# Altium schematic sheet StrainGuageNode.SchDoc
size A4
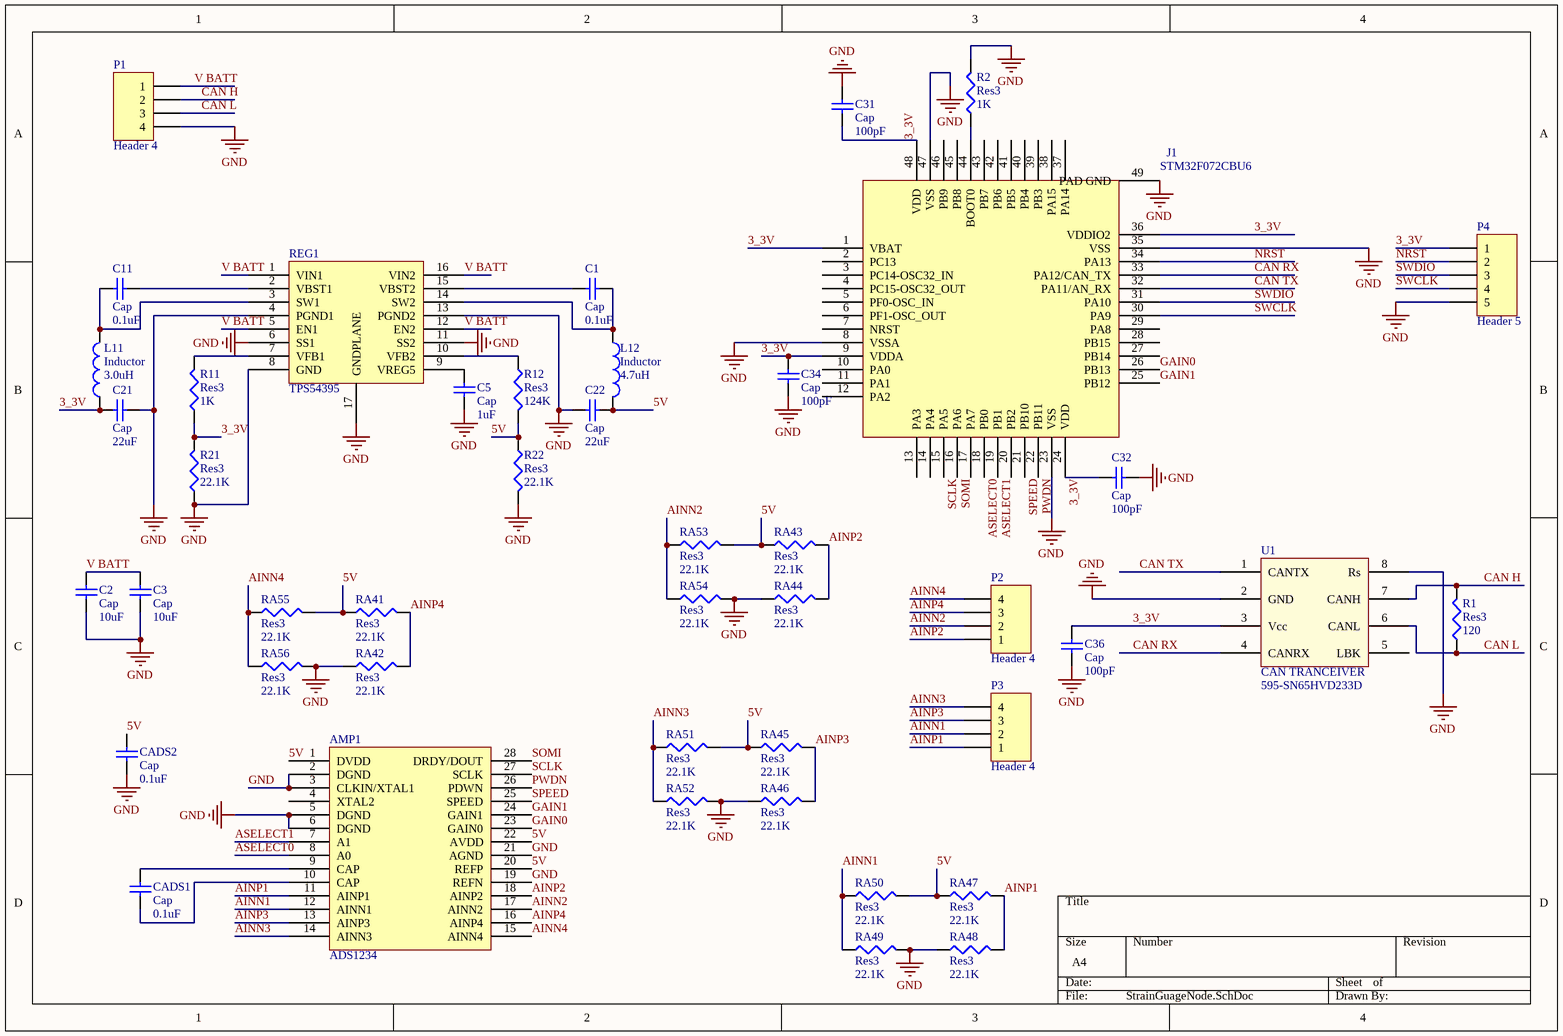
[diagram p0: StrainGuageNode.SchDoc]

## Parts
AMP1  ADS1234  [ADS1234]
C1  Cap  value 0.1uF  [R0805]
C2  Cap  value 10uF  [R0805]
C3  Cap  value 10uF  [R0805]
C5  Cap  value 1uF  [R0805]
C11  Cap  value 0.1uF  [R0805]
C21  Cap  value 22uF  [R0805]
C22  Cap  value 22uF  [R0805]
C31  Cap  value 100pF  [R0805]
C32  Cap  value 100pF  [R0805]
C34  Cap  value 100pF  [R0805]
C36  Cap  value 100pF  [R0805]
CADS1  Cap  value 0.1uF  [R0805]
CADS2  Cap  value 0.1uF  [R0805]
J1  STM32F072CBU6  [STM32F072CBU6 - duplicate]
L11  Inductor  value 3.0uH  [Inductor]
L12  Inductor  value 4.7uH  [Inductor]
P1  Header 4  [HDR1X4]
P2  Header 4  [HDR1X4]
P3  Header 4  [HDR1X4]
P4  Header 5  [HDR1X5]
R1  Res3  value 120  [R0805]
R2  Res3  value 1K  [R0805]
R11  Res3  value 1K  [R0805]
R12  Res3  value 124K  [R0805]
R21  Res3  value 22.1K  [R0805]
R22  Res3  value 22.1K  [R0805]
RA41  Res3  value 22.1K  [R0805]
RA42  Res3  value 22.1K  [R0805]
RA43  Res3  value 22.1K  [R0805]
RA44  Res3  value 22.1K  [R0805]
RA45  Res3  value 22.1K  [R0805]
RA46  Res3  value 22.1K  [R0805]
RA47  Res3  value 22.1K  [R0805]
RA48  Res3  value 22.1K  [R0805]
RA49  Res3  value 22.1K  [R0805]
RA50  Res3  value 22.1K  [R0805]
RA51  Res3  value 22.1K  [R0805]
RA52  Res3  value 22.1K  [R0805]
RA53  Res3  value 22.1K  [R0805]
RA54  Res3  value 22.1K  [R0805]
RA55  Res3  value 22.1K  [R0805]
RA56  Res3  value 22.1K  [R0805]
REG1  TPS54395  [TPS54395]
U1  CAN TRANCEIVER  Supplier Part Number 1: 595-SN65HVD233D  [SOP8]

## Nets
GND: AMP1.2(DGND) AMP1.3(CLKIN/XTAL1) AMP1.5(DGND) AMP1.6(DGND) AMP1.19(REFN) AMP1.21(AGND) C2.2 C3.2 C5.2 C21.1 C22.1 C31.1 C32.1 C34.1 C36.1 CADS2.2 J1.8(VSSA) J1.23(VSS) J1.35(VSS) J1.47(VSS) J1.49(PAD_GND) P1.4 P4.5 R2.2 R21.1 R22.1 RA42.2 RA44.2 RA46.2 RA48.2 RA49.1 RA52.1 RA54.1 RA56.1 REG1.4(PGND1) REG1.6(SS1) REG1.8(GND) REG1.11(SS2) REG1.13(PGND2) REG1.17(GNDPLANE) U1.2(GND) U1.8(Rs)
3_3V: C21.2 C31.2 C32.2 C34.2 C36.2 J1.1(VBAT) J1.9(VDDA) J1.24(VDD) J1.36(VDDIO2) J1.48(VDD) L11.1 P4.1 R11.1 R21.2 U1.3(Vcc)
5V: AMP1.1(DVDD) AMP1.20(REFP) AMP1.22(AVDD) C22.2 CADS2.1 L12.1 R12.1 R22.2 RA41.2 RA43.2 RA45.2 RA47.2 RA50.1 RA51.1 RA53.1 RA55.1
AINN1: AMP1.12(AINN1) P3.2 RA49.2 RA50.2
AINN2: AMP1.17(AINN2) P2.2 RA53.2 RA54.2
AINN3: AMP1.14(AINN3) P3.4 RA51.2 RA52.2
AINN4: AMP1.15(AINN4) P2.4 RA55.2 RA56.2
AINP1: AMP1.11(AINP1) P3.1 RA47.1 RA48.1
AINP2: AMP1.18(AINP2) P2.1 RA43.1 RA44.1
AINP3: AMP1.13(AINP3) P3.3 RA45.1 RA46.1
AINP4: AMP1.16(AINP4) P2.3 RA41.1 RA42.1
ASELECT0: AMP1.8(A0) J1.18(PB0)
ASELECT1: AMP1.7(A1) J1.19(PB1)
CAN H: P1.2 R1.2 U1.7(CANH)
CAN L: P1.3 R1.1 U1.6(CANL)
CAN RX: J1.33(PA12/CAN_TX) U1.4(CANRX)
CAN TX: J1.32(PA11/AN_RX) U1.1(CANTX)
GAIN0: AMP1.23(GAIN0) J1.26(PB13)
GAIN1: AMP1.24(GAIN1) J1.25(PB12)
NRST: J1.34(PA13) P4.2
PWDN: AMP1.26(PDWN) J1.22(PB11)
SCLK: AMP1.27(SCLK) J1.15(PA5)
SOMI: AMP1.28(DRDY/DOUT) J1.16(PA6)
SPEED: AMP1.25(SPEED) J1.21(PB10)
SWCLK: J1.30(PA9) P4.4
SWDIO: J1.31(PA10) P4.3
V BATT: C2.1 C3.1 P1.1 REG1.1(VIN1) REG1.5(EN1) REG1.12(EN2) REG1.16(VIN2)
NetAMP1_9: AMP1.9(CAP) CADS1.2
NetAMP1_10: AMP1.10(CAP) CADS1.1
NetC1_1: C1.1 REG1.15(VBST2)
NetC1_2: C1.2 L12.2 REG1.14(SW2)
NetC5_1: C5.1 REG1.9(VREG5)
NetC11_1: C11.1 REG1.2(VBST1)
NetC11_2: C11.2 L11.2 REG1.3(SW1)
NetJ1_44: J1.44(BOOT0) R2.1
NetR11_2: R11.2 REG1.7(VFB1)
NetR12_2: R12.2 REG1.10(VFB2)

Not connected (* = marked no-connect by the designer): AMP1 4(XTAL2); J1 2(PC13) 3(PC14-OSC32_IN) 4(PC15-OSC32_OUT) 5(PF0-OSC_IN) 6(PF1-OSC_OUT) 7(NRST) 10(PA0) 11(PA1) 12(PA2) 13(PA3) 14(PA4) 17(PA7) 20(PB2) 27(PB14) 28(PB15) 29(PA8) 37(PA14) 38(PA15) 39(PB3) 40(PB4) 41(PB5) 42(PB6) 43(PB7) 45(PB8) 46(PB9); U1 5(LBK)

## Library data of the parts
C1-C3 C5 C11 C21 C22 C31 C32 C34 C36 CADS1 CADS2 = Cap: Capacitor; Published: 8-Jun-2000; LatestRevisionDate: 17-Jul-2002; LatestRevisionNote: Re-released for DXP Platform.; PackageReference: RAD-0.3; Publisher: Altium Limited; PackageDescription: Radial Cap, Thru-Hole; 2 Leads; 0.3 in Pin Spacing
J1 = STM32F072CBU6: MICROCONTROLLER
L11 L12 = Inductor: Code_IEC: 1005; Published: 8-Jun-2000; LatestRevisionDate: 29-May-2009; LatestRevisionNote: IPC-7351 Footprint Added.; PackageReference: 0402-A; Publisher: Altium Limited; PackageDescription: Chip Inductor; Code_JEITA: 0402
P1-P3 = Header 4: Header, 4-Pin; LatestRevisionDate: 17-Jul-2002; LatestRevisionNote: Re-released for DXP Platform.; Publisher: Altium Limited
P4 = Header 5: Header, 5-Pin; LatestRevisionDate: 17-Jul-2002; LatestRevisionNote: Re-released for DXP Platform.; Publisher: Altium Limited
R1 R2 R11 R12 R21 R22 RA41-RA56 = Res3: Resistor; Published: 8-Jun-2000; LatestRevisionDate: 29-May-2009; LatestRevisionNote: IPC-7351 Footprint Added.; PackageReference: J1-0603; Publisher: Altium Limited; PackageDescription: Chip Resistor
REG1 = TPS54395: Dual Channel Buck Converter
U1 = 595-SN65HVD233: Supplier 1: Mouser